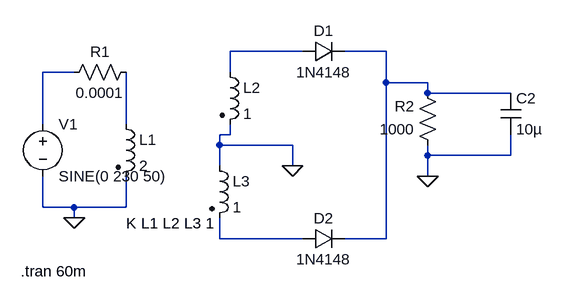
[diagram p0: schematic full wave rectifier with filter.asc]
full wave rectifier with filter.asc, the LTspice schematic file:
Version 4
SHEET 1 880 680
WIRE 320 -16 208 -16
WIRE 448 -16 384 -16
WIRE -32 16 -80 16
WIRE 208 16 208 -16
WIRE 448 32 448 -16
WIRE 512 32 448 32
WIRE 512 48 512 32
WIRE 640 48 512 48
WIRE -80 96 -80 16
WIRE 48 96 48 16
WIRE 208 112 208 96
WIRE 208 112 192 112
WIRE 192 128 192 112
WIRE 304 128 192 128
WIRE 512 144 512 128
WIRE 640 144 640 112
WIRE 640 144 512 144
WIRE 192 160 192 128
WIRE 304 160 304 128
WIRE 512 176 512 144
WIRE -80 224 -80 176
WIRE -32 224 -80 224
WIRE 48 224 48 176
WIRE 48 224 -32 224
WIRE -32 240 -32 224
WIRE 192 272 192 240
WIRE 320 272 192 272
WIRE 448 272 448 32
WIRE 448 272 384 272
FLAG 512 176 0
FLAG -32 240 0
FLAG 304 160 0
SYMBOL ind2 32 80 R0
SYMATTR InstName L1
SYMATTR Value 2
SYMATTR Type ind
SYMBOL ind2 192 0 R0
SYMATTR InstName L2
SYMATTR Value 1
SYMATTR Type ind
SYMBOL ind2 176 144 R0
SYMATTR InstName L3
SYMATTR Value 1
SYMATTR Type ind
SYMBOL voltage -80 80 R0
WINDOW 123 0 0 Left 0
WINDOW 39 0 0 Left 0
SYMATTR InstName V1
SYMATTR Value SINE(0 230 50)
SYMBOL diode 320 0 R270
WINDOW 0 32 32 VTop 2
WINDOW 3 0 32 VBottom 2
SYMATTR InstName D1
SYMATTR Value 1N4148
SYMBOL diode 320 288 R270
WINDOW 0 32 32 VTop 2
WINDOW 3 0 32 VBottom 2
SYMATTR InstName D2
SYMATTR Value 1N4148
SYMBOL res 64 0 R90
WINDOW 0 0 56 VBottom 2
WINDOW 3 32 56 VTop 2
SYMATTR InstName R1
SYMATTR Value 0.0001
SYMBOL res 528 144 R180
WINDOW 0 36 76 Left 2
WINDOW 3 36 40 Left 2
SYMATTR InstName R2
SYMATTR Value 1000
SYMBOL cap 624 48 R0
SYMATTR InstName C2
SYMATTR Value 10µ
TEXT 48 248 Left 2 !K L1 L2 L3 1
TEXT -114 322 Left 2 !.tran 60m

The netlist it stands for:
* full wave rectifier with filter.asc
L1 N004 0 2
L2 N001 0 1
L3 0 N005 1
V1 N003 0 SINE(0 230 50)
D1 N001 N002 1N4148
D2 N005 N002 1N4148
R1 N004 N003 0.0001
R2 0 N002 1000
C2 N002 0 10µ
.model D D
.lib standard.dio
K L1 L2 L3 1
.tran 60m
.backanno
.end